# EAGLE schematic Patrick (EAGLE 9.6.0)
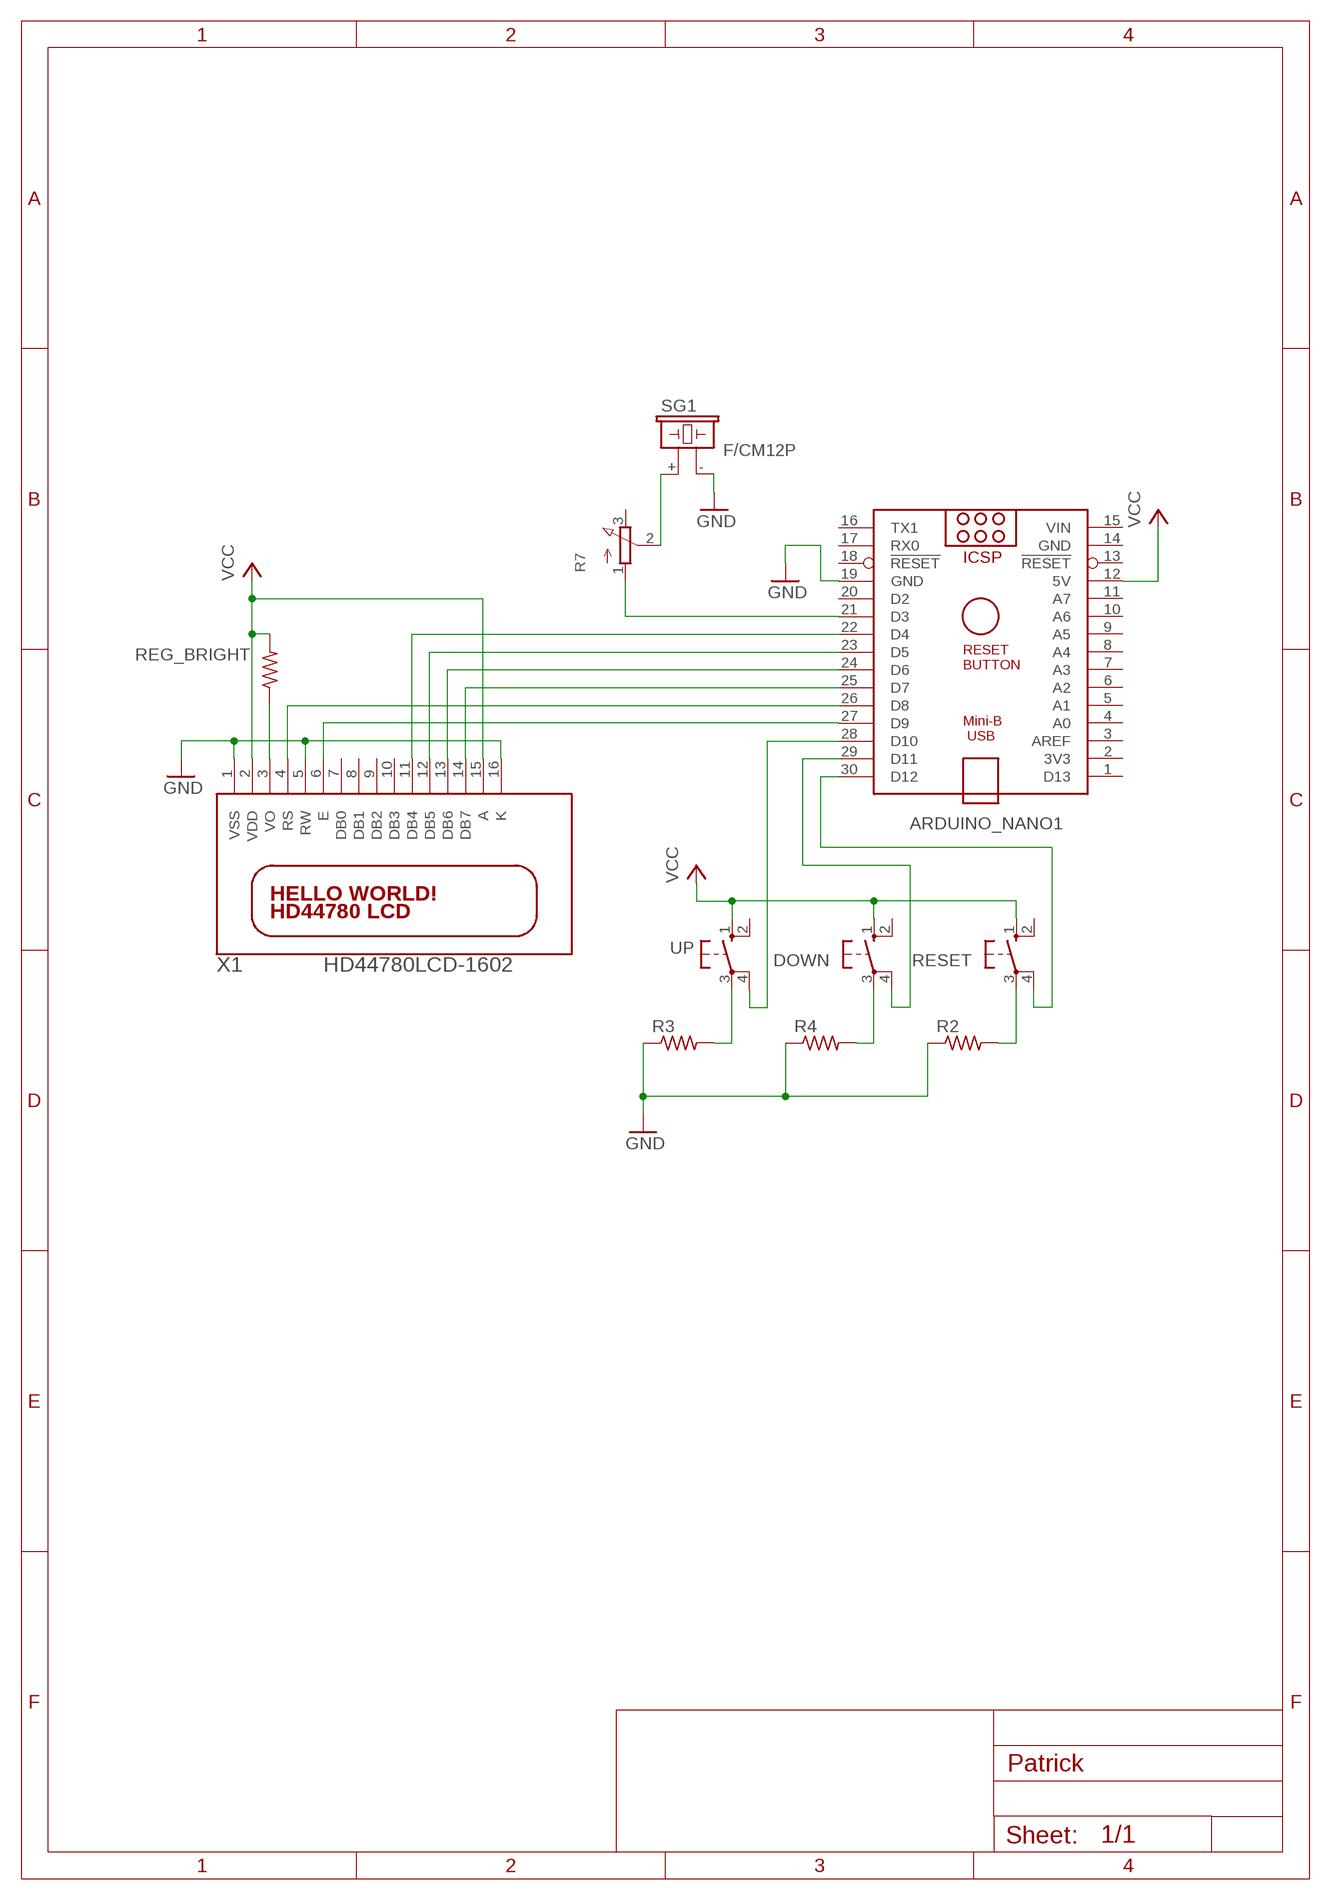
[diagram p0: schematic, sheet 1]

## Parts
ARDUINO_NANO1  ARDUINO_NANO  [ARDUINO_NANO]
DOWN  40-XX  [B3F-40XX]
R2  FLIPFLOP-RES  [0805-THM]
R3  FLIPFLOP-RES  [0805-THM]
R4  FLIPFLOP-RES  [0805-THM]
R7  3RP/1610N  [3RP/1610N]
REG_BRIGHT  FLIPFLOP-RES  [0805-THM]
RESET  40-XX  [B3F-40XX]
SG1  F/CM12P  [F/CM12P]
UP  40-XX  [B3F-40XX]
X1  HD44780LCD-1602  [LCD1602]

## Nets
GND [Alimentacao]: ARDUINO_NANO1.19(GND) R2.1 R3.1 R4.1 SG1.- X1.1(VSS) X1.5(RW) X1.16(K)
N$1: REG_BRIGHT.1 X1.3(VO)
N$2: ARDUINO_NANO1.28(D10) UP.4(P1)
N$3: ARDUINO_NANO1.29(D11) DOWN.4(P1)
N$4: R3.2 UP.3(P)
N$5: DOWN.3(P) R4.2
N$6: R2.2 RESET.3(P)
N$7: ARDUINO_NANO1.30(D12) RESET.4(P1)
N$8: ARDUINO_NANO1.27(D9) X1.6(E)
N$9: ARDUINO_NANO1.26(D8) X1.4(RS)
N$10: ARDUINO_NANO1.25(D7) X1.14(DB7)
N$11: ARDUINO_NANO1.24(D6) X1.13(DB6)
N$12: ARDUINO_NANO1.23(D5) X1.12(DB5)
N$13: ARDUINO_NANO1.22(D4) X1.11(DB4)
N$15: ARDUINO_NANO1.21(D3) R7.1(A)
N$16: R7.2(S) SG1.+
VCC [Alimentacao]: ARDUINO_NANO1.12(5V) DOWN.1(S) REG_BRIGHT.2 RESET.1(S) UP.1(S) X1.2(VDD) X1.15(A)
Unconnected: ARDUINO_NANO1.1(D13) ARDUINO_NANO1.2(3V3) ARDUINO_NANO1.3(AREF) ARDUINO_NANO1.4(A0) ARDUINO_NANO1.5(A1) ARDUINO_NANO1.6(A2) ARDUINO_NANO1.7(A3) ARDUINO_NANO1.8(A4) ARDUINO_NANO1.9(A5) ARDUINO_NANO1.10(A6) ARDUINO_NANO1.11(A7) ARDUINO_NANO1.13(!RESET) ARDUINO_NANO1.16(TX1) ARDUINO_NANO1.17(RX0) ARDUINO_NANO1.18(!RESET) ARDUINO_NANO1.20(D2) DOWN.2(S1) R7.3(E) RESET.2(S1) UP.2(S1) X1.7(DB0) X1.8(DB1) X1.9(DB2) X1.10(DB3)

## Power pins joined to a net without a drawn wire
GND: ARDUINO_NANO1.14(GND)
VIN: ARDUINO_NANO1.15(VIN)

## Library data of the parts
ARDUINO_NANO1 = ArduinoNanoV30:ARDUINO_NANO: Arduino Nano V3.0 Overview: The Arduino Nano is a small, complete, and breadboard-friendly board based on the ATmega328 (Arduino Nano 3.x) or ATmega168 (Arduino Nano 2.x). It has more or less the same functionality of the Arduino Duemilanove, but in a different package. It lacks only a DC power jack, and works with a Mini-B USB cable instead of a standard one. The Nano was designed and is being produced by Gravitech. Specifications: Microcontroller Atmel ATmega168 or ATmega328 Operating Voltage (logic level) 5 V Input Voltage (recommended) 7-12 V Input Voltage (limits) 6-20 V Digital I/O Pins 14 (of which 6 provide PWM output) Analog Input Pins 8 DC Current per I/O Pin 40 mA Flash Memory 16 KB (ATmega168) or 32 KB (ATmega328) of which 2 KB used by bootloader SRAM 1 KB (ATmega168) or 2 KB (ATmega328) EEPROM 512 bytes (ATmega168) or 1 KB (ATmega328) Clock Speed 16 MHz Dimensions 0.73" x 1.70" Length 45 mm Width 18 mm Weigth 5 g Power: The Arduino Nano can be powered via the Mini-B USB connection, 6-20V unregulated external power supply (pin 30), or 5V regulated external power supply (pin 27). The power source is automatically selected to the highest voltage source. Memory: The ATmega168 has 16 KB of flash memory for storing code (of which 2 KB is used for the bootloader); the ATmega328 has 32 KB, (also with 2 KB used for the bootloader). The ATmega168 has 1 KB of SRAM and 512 bytes of EEPROM (which can be read and written with the EEPROM library); the ATmega328 has 2 KB of SRAM and 1 KB of EEPROM. Input and Output: Each of the 14 digital pins on the Nano can be used as an input or output, using pinMode(), digitalWrite(), and digitalRead() functions. They operate at 5 volts. Each pin can provide or receive a maximum of 40 mA and has an internal pull-up resistor (disconnected by default) of 20-50 kOhms. In addition, some pins have specialized functions. Visit Arduino - ArduinoBoardNano <https://www.arduino.cc/en/Main/ArduinoBoardNano>
DOWN RESET UP = switch-omron:40-XX: OMRON SWITCH; MF: OMRON COMPONENTS USA; MPN: B3F-4000; OC_FARNELL: 176434; OC_NEWARK: 36K3105
R2-R4 REG_BRIGHT = adafruit:FLIPFLOP-RES: Flip Flop resistor An 0805 resistor inside a standard 1/4W 5% resistor. Makes for easy mods
R7 = pot:3RP/1610N: 16mm Potentiometer one level Source: http://www.alphapotentiometers.net/html/16mm_pot_2.html
SG1 = buzzer:F/CM12P: BUZZER Source: Buerklin; OC_FARNELL: unknown; OC_NEWARK: unknown
X1 = adafruit:HD44780LCD: HD44780 LCD Standard character type LCDs, available in sizes from 8x1 to 40x4!

## Net classes
0 default: width 0.508 mm
1 Alimentacao: width 1.016 mm